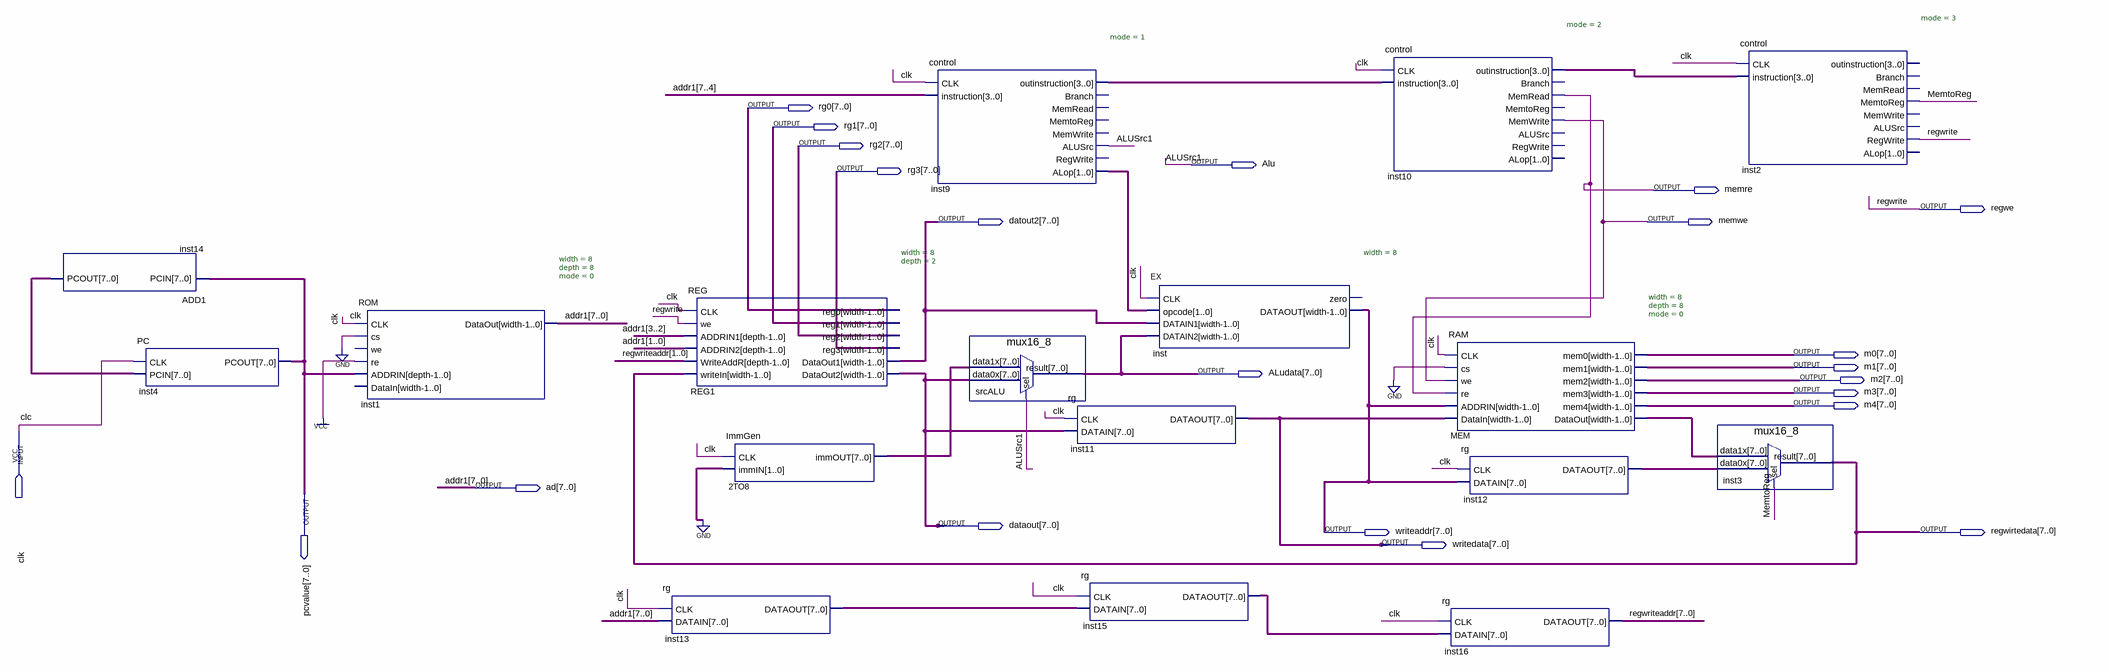
[diagram p0: schematic sheet]
// Quartus schematic cpu.bdf as structural Verilog: 17 symbols, 22 pins
module cpu (
  input  clk,
  output [7:0] rg0,
  output [7:0] rg1,
  output [7:0] rg2,
  output Alu,
  output [7:0] rg3,
  output memre,
  output regwe,
  output [7:0] datout2,
  output memwe,
  output [7:0] m0,
  output [7:0] m1,
  output [7:0] ALudata,
  output [7:0] m2,
  output [7:0] m3,
  output [7:0] m4,
  output [7:0] ad,
  output [7:0] pcvalue,
  output [7:0] dataout,
  output [7:0] writeaddr,
  output [7:0] regwirtedata,
  output [7:0] writedata
);

  wire MemtoReg;
  wire [1:0] inst9_alop;
  wire [3:0] inst9_outinstruction, inst10_outinstruction;
  wire [7:0] inst12_dataout, inst13_dataout, inst14_pcout, inst15_dataout, MEM_dataout, n2TO8_immout,
       regwriteaddr;

  ADD1 inst14 (.PCIN(pcvalue), .PCOUT(inst14_pcout));
  PC inst4 (.CLK(clk), .PCIN(inst14_pcout), .PCOUT(pcvalue));
  ROM #(.width(8), .depth(8), .mode(0)) inst1 (
    .CLK(clk), .cs(1'b0), .re(1'b1), .ADDRIN(pcvalue), .DataOut(ad));  // open: we, DataIn
  rg inst13 (.CLK(clk), .DATAIN(ad), .DATAOUT(inst13_dataout));
  REG #(.width(8), .depth(2)) REG1 (
    .CLK(clk), .we(regwe), .ADDRIN1(ad[3:2]), .ADDRIN2(ad[1:0]), .WriteAddR(regwriteaddr[1:0]),
    .writeIn(regwirtedata), .reg0(rg0), .reg1(rg1), .reg2(rg2), .reg3(rg3), .DataOut1(datout2),
    .DataOut2(dataout));
  ImmGen u_2TO8 (.CLK(clk), .immIN(2'b00), .immOUT(n2TO8_immout));
  control #(.mode(1)) inst9 (
    .CLK(clk), .instruction(ad[7:4]), .outinstruction(inst9_outinstruction), .ALUSrc(Alu), .ALop(inst9_alop));  // open: Branch, MemRead, MemtoReg, MemWrite, RegWrite
  mux16_8 srcALU (.data1x(n2TO8_immout), .data0x(dataout), .sel(Alu), .result(ALudata));
  rg inst11 (.CLK(clk), .DATAIN(dataout), .DATAOUT(writedata));
  rg inst15 (.CLK(clk), .DATAIN(inst13_dataout), .DATAOUT(inst15_dataout));
  EX #(.width(8)) inst (
    .CLK(clk), .opcode(inst9_alop), .DATAIN1(datout2), .DATAIN2(ALudata), .DATAOUT(writeaddr));  // open: zero
  control #(.mode(2)) inst10 (
    .CLK(clk), .instruction(inst9_outinstruction), .outinstruction(inst10_outinstruction), .MemRead(memre),
    .MemWrite(memwe));  // open: Branch, MemtoReg, ALUSrc, RegWrite, ALop
  RAM #(.width(8), .depth(8), .mode(0)) MEM (
    .CLK(clk), .cs(1'b0), .we(memwe), .re(memre), .ADDRIN(writeaddr), .DataIn(writedata), .mem0(m0),
    .mem1(m1), .mem2(m2), .mem3(m3), .mem4(m4), .DataOut(MEM_dataout));
  rg inst12 (.CLK(clk), .DATAIN(writeaddr), .DATAOUT(inst12_dataout));
  rg inst16 (.CLK(clk), .DATAIN(inst15_dataout), .DATAOUT(regwriteaddr));
  control #(.mode(3)) inst2 (
    .CLK(clk), .instruction(inst10_outinstruction), .MemtoReg(MemtoReg), .RegWrite(regwe));  // open: outinstruction, Branch, MemRead, MemWrite, ALUSrc, ALop
  mux16_8 inst3 (.data1x(MEM_dataout), .data0x(inst12_dataout), .sel(MemtoReg), .result(regwirtedata));

  // Other names for the same wires on the sheet: addr1[7:0] = ad; ALUSrc1 = Alu; clc = clk; regwrite = regwe
endmodule
